# Altium schematic sheet som_connectors.SchDoc
size A3; PageSetup: Record=PageOptions|CenterHorizontal=True|CenterVertical=True|PrintScale=0.73|XCorrection=1.00|YCorrection=1.00|PrintKind=1|BorderSize=5000000|LeftOffset=0|BottomOffset=0|Orientation=2|PaperLength=1000|PaperWidth=1000|Scale=100|PaperSource=7|PrintQuality=-4|MediaType=1|DitherType=10|PaperKind=A4 (210 x 297 ìì)|PrintScaleMode=1
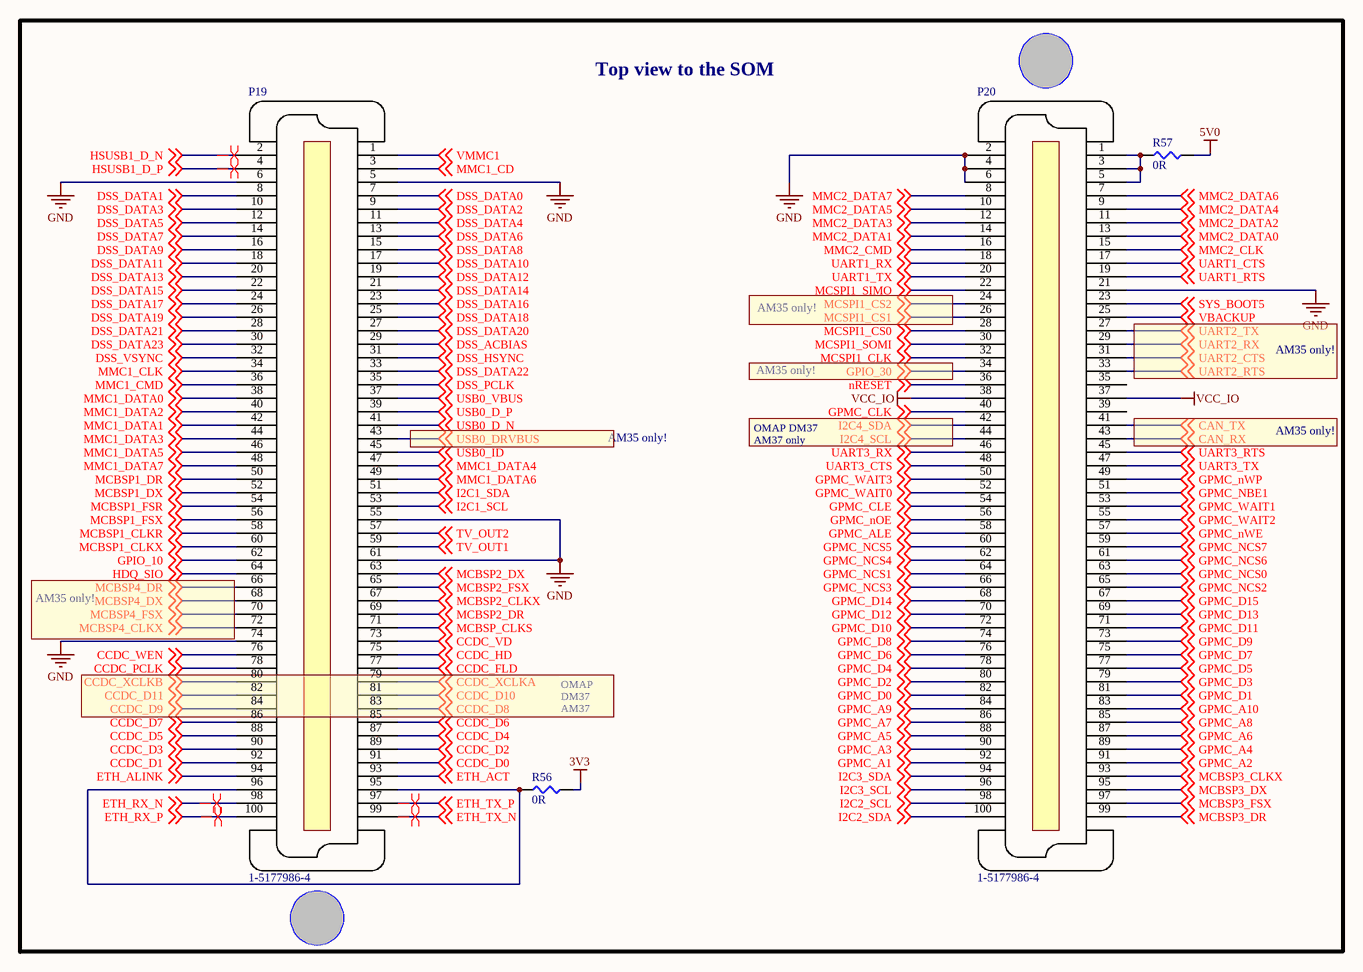
[diagram p0: som_connectors.SchDoc]

## Parts
P19  1-5177986-4  [1-5177986-4]
P20  1-5177986-4  [1-5177986-4]
R56  value 0R  [CHIP0805]  (hidden comment: R0805)
R57  value 0R  [CHIP0805]  (hidden comment: R0805)

## Nets
3V3: R56.2
5V0: R57.2
GND: P19.5 P19.6 P19.55 P19.61 P19.74 P20.2 P20.4 P20.6 P20.21
VCC_IO: P20.37 P20.38
CAN_RX: P20.43 ; off-sheet CAN_RX
CAN_TX: P20.41 ; off-sheet CAN_TX
CCDC_D0: P19.91 ; off-sheet CCDC_D0
CCDC_D1: P19.92 ; off-sheet CCDC_D1
CCDC_D2: P19.89 ; off-sheet CCDC_D2
CCDC_D3: P19.90 ; off-sheet CCDC_D3
CCDC_D4: P19.87 ; off-sheet CCDC_D4
CCDC_D5: P19.88 ; off-sheet CCDC_D5
CCDC_D6: P19.85 ; off-sheet CCDC_D6
CCDC_D7: P19.86 ; off-sheet CCDC_D7
CCDC_D8: P19.83 ; off-sheet CCDC_D8
CCDC_D9: P19.84 ; off-sheet CCDC_D9
CCDC_D10: P19.81 ; off-sheet CCDC_D10
CCDC_D11: P19.82 ; off-sheet CCDC_D11
CCDC_FLD: P19.77 ; off-sheet CCDC_FLD
CCDC_HD: P19.75 ; off-sheet CCDC_HD
CCDC_PCLK: P19.78 ; off-sheet CCDC_PCLK
CCDC_VD: P19.73 ; off-sheet CCDC_VD
CCDC_WEN: P19.76 ; off-sheet CCDC_WEN
CCDC_XCLKA: P19.79 ; off-sheet CCDC_XCLKA
CCDC_XCLKB: P19.80 ; off-sheet CCDC_XCLKB
DSS_ACBIAS: P19.29 ; off-sheet DSS_ACBIAS
DSS_DATA0: P19.7 ; off-sheet DSS_DATA0
DSS_DATA1: P19.8 ; off-sheet DSS_DATA1
DSS_DATA2: P19.9 ; off-sheet DSS_DATA2
DSS_DATA3: P19.10 ; off-sheet DSS_DATA3
DSS_DATA4: P19.11 ; off-sheet DSS_DATA4
DSS_DATA5: P19.12 ; off-sheet DSS_DATA5
DSS_DATA6: P19.13 ; off-sheet DSS_DATA6
DSS_DATA7: P19.14 ; off-sheet DSS_DATA7
DSS_DATA8: P19.15 ; off-sheet DSS_DATA8
DSS_DATA9: P19.16 ; off-sheet DSS_DATA9
DSS_DATA10: P19.17 ; off-sheet DSS_DATA10
DSS_DATA11: P19.18 ; off-sheet DSS_DATA11
DSS_DATA12: P19.19 ; off-sheet DSS_DATA12
DSS_DATA13: P19.20 ; off-sheet DSS_DATA13
DSS_DATA14: P19.21 ; off-sheet DSS_DATA14
DSS_DATA15: P19.22 ; off-sheet DSS_DATA15
DSS_DATA16: P19.23 ; off-sheet DSS_DATA16
DSS_DATA17: P19.24 ; off-sheet DSS_DATA17
DSS_DATA18: P19.25 ; off-sheet DSS_DATA18
DSS_DATA19: P19.26 ; off-sheet DSS_DATA19
DSS_DATA20: P19.27 ; off-sheet DSS_DATA20
DSS_DATA21: P19.28 ; off-sheet DSS_DATA21
DSS_DATA22: P19.33 ; off-sheet DSS_DATA22
DSS_DATA23: P19.30 ; off-sheet DSS_DATA23
DSS_HSYNC: P19.31 ; off-sheet DSS_HSYNC
DSS_PCLK: P19.35 ; off-sheet DSS_PCLK
DSS_VSYNC: P19.32 ; off-sheet DSS_VSYNC
ETH_ACT: P19.93 ; off-sheet ETH_ACT
ETH_ALINK: P19.94 ; off-sheet ETH_ALINK
ETH_RX_N: P19.98 ; off-sheet ETH_RX_N
ETH_RX_P: P19.100 ; off-sheet ETH_RX_P
ETH_TX_N: P19.99 ; off-sheet ETH_TX_N
ETH_TX_P: P19.97 ; off-sheet ETH_TX_P
GPIO_10: P19.62 ; off-sheet GPIO_10
GPIO_30: P20.34 ; off-sheet GPIO_30
GPMC_A1: P20.92 ; off-sheet GPMC_A1
GPMC_A2: P20.91 ; off-sheet GPMC_A2
GPMC_A3: P20.90 ; off-sheet GPMC_A3
GPMC_A4: P20.89 ; off-sheet GPMC_A4
GPMC_A5: P20.88 ; off-sheet GPMC_A5
GPMC_A6: P20.87 ; off-sheet GPMC_A6
GPMC_A7: P20.86 ; off-sheet GPMC_A7
GPMC_A8: P20.85 ; off-sheet GPMC_A8
GPMC_A9: P20.84 ; off-sheet GPMC_A9
GPMC_A10: P20.83 ; off-sheet GPMC_A10
GPMC_ALE: P20.58 ; off-sheet GPMC_ALE
GPMC_CLE: P20.54 ; off-sheet GPMC_CLE
GPMC_CLK: P20.40 ; off-sheet GPMC_CLK
GPMC_D0: P20.82 ; off-sheet GPMC_D0
GPMC_D1: P20.81 ; off-sheet GPMC_D1
GPMC_D2: P20.80 ; off-sheet GPMC_D2
GPMC_D3: P20.79 ; off-sheet GPMC_D3
GPMC_D4: P20.78 ; off-sheet GPMC_D4
GPMC_D5: P20.77 ; off-sheet GPMC_D5
GPMC_D6: P20.76 ; off-sheet GPMC_D6
GPMC_D7: P20.75 ; off-sheet GPMC_D7
GPMC_D8: P20.74 ; off-sheet GPMC_D8
GPMC_D9: P20.73 ; off-sheet GPMC_D9
GPMC_D10: P20.72 ; off-sheet GPMC_D10
GPMC_D11: P20.71 ; off-sheet GPMC_D11
GPMC_D12: P20.70 ; off-sheet GPMC_D12
GPMC_D13: P20.69 ; off-sheet GPMC_D13
GPMC_D14: P20.68 ; off-sheet GPMC_D14
GPMC_D15: P20.67 ; off-sheet GPMC_D15
GPMC_NBE1: P20.51 ; off-sheet GPMC_NBE1
GPMC_NCS0: P20.63 ; off-sheet GPMC_NCS0
GPMC_NCS1: P20.64 ; off-sheet GPMC_NCS1
GPMC_NCS2: P20.65 ; off-sheet GPMC_NCS2
GPMC_NCS3: P20.66 ; off-sheet GPMC_NCS3
GPMC_NCS4: P20.62 ; off-sheet GPMC_NCS4
GPMC_NCS5: P20.60 ; off-sheet GPMC_NCS5
GPMC_NCS6: P20.61 ; off-sheet GPMC_NCS6
GPMC_NCS7: P20.59 ; off-sheet GPMC_NCS7
GPMC_nOE: P20.56 ; off-sheet GPMC_nOE
GPMC_nWE: P20.57 ; off-sheet GPMC_nWE
GPMC_nWP: P20.49 ; off-sheet GPMC_nWP
GPMC_WAIT0: P20.52 ; off-sheet GPMC_WAIT0
GPMC_WAIT1: P20.53 ; off-sheet GPMC_WAIT1
GPMC_WAIT2: P20.55 ; off-sheet GPMC_WAIT2
GPMC_WAIT3: P20.50 ; off-sheet GPMC_WAIT3
HDQ_SIO: P19.64 ; off-sheet HDQ_SIO
HSUSB1_D_N: P19.2 ; off-sheet HSUSB1_D_N
HSUSB1_D_P: P19.4 ; off-sheet HSUSB1_D_P
I2C1_SCL: P19.53 ; off-sheet I2C1_SCL
I2C1_SDA: P19.51 ; off-sheet I2C1_SDA
I2C2_SCL: P20.98 ; off-sheet I2C2_SCL
I2C2_SDA: P20.100 ; off-sheet I2C2_SDA
I2C3_SCL: P20.96 ; off-sheet I2C3_SCL
I2C3_SDA: P20.94 ; off-sheet I2C3_SDA
I2C4_SCL: P20.44 ; off-sheet I2C4_SCL
I2C4_SDA: P20.42 ; off-sheet I2C4_SDA
MCBSP1_CLKR: P19.58 ; off-sheet MCBSP1_CLKR
MCBSP1_CLKX: P19.60 ; off-sheet MCBSP1_CLKX
MCBSP1_DR: P19.50 ; off-sheet MCBSP1_DR
MCBSP1_DX: P19.52 ; off-sheet MCBSP1_DX
MCBSP1_FSR: P19.54 ; off-sheet MCBSP1_FSR
MCBSP1_FSX: P19.56 ; off-sheet MCBSP1_FSX
MCBSP2_CLKX: P19.67 ; off-sheet MCBSP2_CLKX
MCBSP2_DR: P19.69 ; off-sheet MCBSP2_DR
MCBSP2_DX: P19.63 ; off-sheet MCBSP2_DX
MCBSP2_FSX: P19.65 ; off-sheet MCBSP2_FSX
MCBSP3_CLKX: P20.93 ; off-sheet MCBSP3_CLKX
MCBSP3_DR: P20.99 ; off-sheet MCBSP3_DR
MCBSP3_DX: P20.95 ; off-sheet MCBSP3_DX
MCBSP3_FSX: P20.97 ; off-sheet MCBSP3_FSX
MCBSP4_CLKX: P19.72 ; off-sheet MCBSP4_CLKX
MCBSP4_DR: P19.66 ; off-sheet MCBSP4_DR
MCBSP4_DX: P19.68 ; off-sheet MCBSP4_DX
MCBSP4_FSX: P19.70 ; off-sheet MCBSP4_FSX
MCBSP_CLKS: P19.71 ; off-sheet MCBSP_CLKS
MCSPI1_CLK: P20.32 ; off-sheet MCSPI1_CLK
MCSPI1_CS0: P20.28 ; off-sheet MCSPI1_CS0
MCSPI1_CS1: P20.26 ; off-sheet MCSPI1_CS1
MCSPI1_CS2: P20.24 ; off-sheet MCSPI1_CS2
MCSPI1_SIMO: P20.22 ; off-sheet MCSPI1_SIMO
MCSPI1_SOMI: P20.30 ; off-sheet MCSPI1_SOMI
MMC1_CD: P19.3 ; off-sheet MMC1_CD
MMC1_CLK: P19.34 ; off-sheet MMC1_CLK
MMC1_CMD: P19.36 ; off-sheet MMC1_CMD
MMC1_DATA0: P19.38 ; off-sheet MMC1_DATA0
MMC1_DATA1: P19.42 ; off-sheet MMC1_DATA1
MMC1_DATA2: P19.40 ; off-sheet MMC1_DATA2
MMC1_DATA3: P19.44 ; off-sheet MMC1_DATA3
MMC1_DATA4: P19.47 ; off-sheet MMC1_DATA4
MMC1_DATA5: P19.46 ; off-sheet MMC1_DATA5
MMC1_DATA6: P19.49 ; off-sheet MMC1_DATA6
MMC1_DATA7: P19.48 ; off-sheet MMC1_DATA7
MMC2_CLK: P20.15 ; off-sheet MMC2_CLK
MMC2_CMD: P20.16 ; off-sheet MMC2_CMD
MMC2_DATA0: P20.13 ; off-sheet MMC2_DATA0
MMC2_DATA1: P20.14 ; off-sheet MMC2_DATA1
MMC2_DATA2: P20.11 ; off-sheet MMC2_DATA2
MMC2_DATA3: P20.12 ; off-sheet MMC2_DATA3
MMC2_DATA4: P20.9 ; off-sheet MMC2_DATA4
MMC2_DATA5: P20.10 ; off-sheet MMC2_DATA5
MMC2_DATA6: P20.7 ; off-sheet MMC2_DATA6
MMC2_DATA7: P20.8 ; off-sheet MMC2_DATA7
nRESET: P20.36 ; off-sheet nRESET
SYS_BOOT5: P20.23 ; off-sheet SYS_BOOT5
TV_OUT1: P19.59 ; off-sheet TV_OUT1
TV_OUT2: P19.57 ; off-sheet TV_OUT2
UART1_CTS: P20.17 ; off-sheet UART1_CTS
UART1_RTS: P20.19 ; off-sheet UART1_RTS
UART1_RX: P20.18 ; off-sheet UART1_RX
UART1_TX: P20.20 ; off-sheet UART1_TX
UART2_CTS: P20.31 ; off-sheet UART2_CTS
UART2_RTS: P20.33 ; off-sheet UART2_RTS
UART2_RX: P20.29 ; off-sheet UART2_RX
UART2_TX: P20.27 ; off-sheet UART2_TX
UART3_CTS: P20.48 ; off-sheet UART3_CTS
UART3_RTS: P20.45 ; off-sheet UART3_RTS
UART3_RX: P20.46 ; off-sheet UART3_RX
UART3_TX: P20.47 ; off-sheet UART3_TX
USB0_D_N: P19.41 ; off-sheet USB0_D_N
USB0_D_P: P19.39 ; off-sheet USB0_D_P
USB0_DRVBUS: P19.43 ; off-sheet USB0_DRVBUS
USB0_ID: P19.45 ; off-sheet USB0_ID
USB0_VBUS: P19.37 ; off-sheet USB0_VBUS
VBACKUP: P20.25 ; off-sheet VBACKUP
VMMC1: P19.1 ; off-sheet VMMC1
NetP19_95: P19.95 P19.96 R56.1
NetP20_1: P20.1 P20.3 P20.5 R57.1

Not connected (* = marked no-connect by the designer): P20 35 39

## Layout directives
differential pair: ETH_RX_N, ETH_RX_P, ETH_TX_N, ETH_TX_P, HSUSB1_D_N, HSUSB1_D_P

## Notes on the sheet
- Top view to the SOM
- AM35 only!
- OMAP DM37
  AM37 only
- OMAP
  DM37
  AM37

## Library data of the parts
P19 P20 = 1-5177986-4: Fine Pitch SMT Stacking Connectors; Manufacturer: TE Connectivity; Man P/N: 1-5177986-4
R56 R57 = R0805: Film resistor